# Altium schematic sheet Regulator_9V0_to_5V0.SchDoc: Buck Converter 9v to 5v0
size B; DocumentNumber: 1; Revision: 1; SheetNumber: 1; SheetTotal: 3
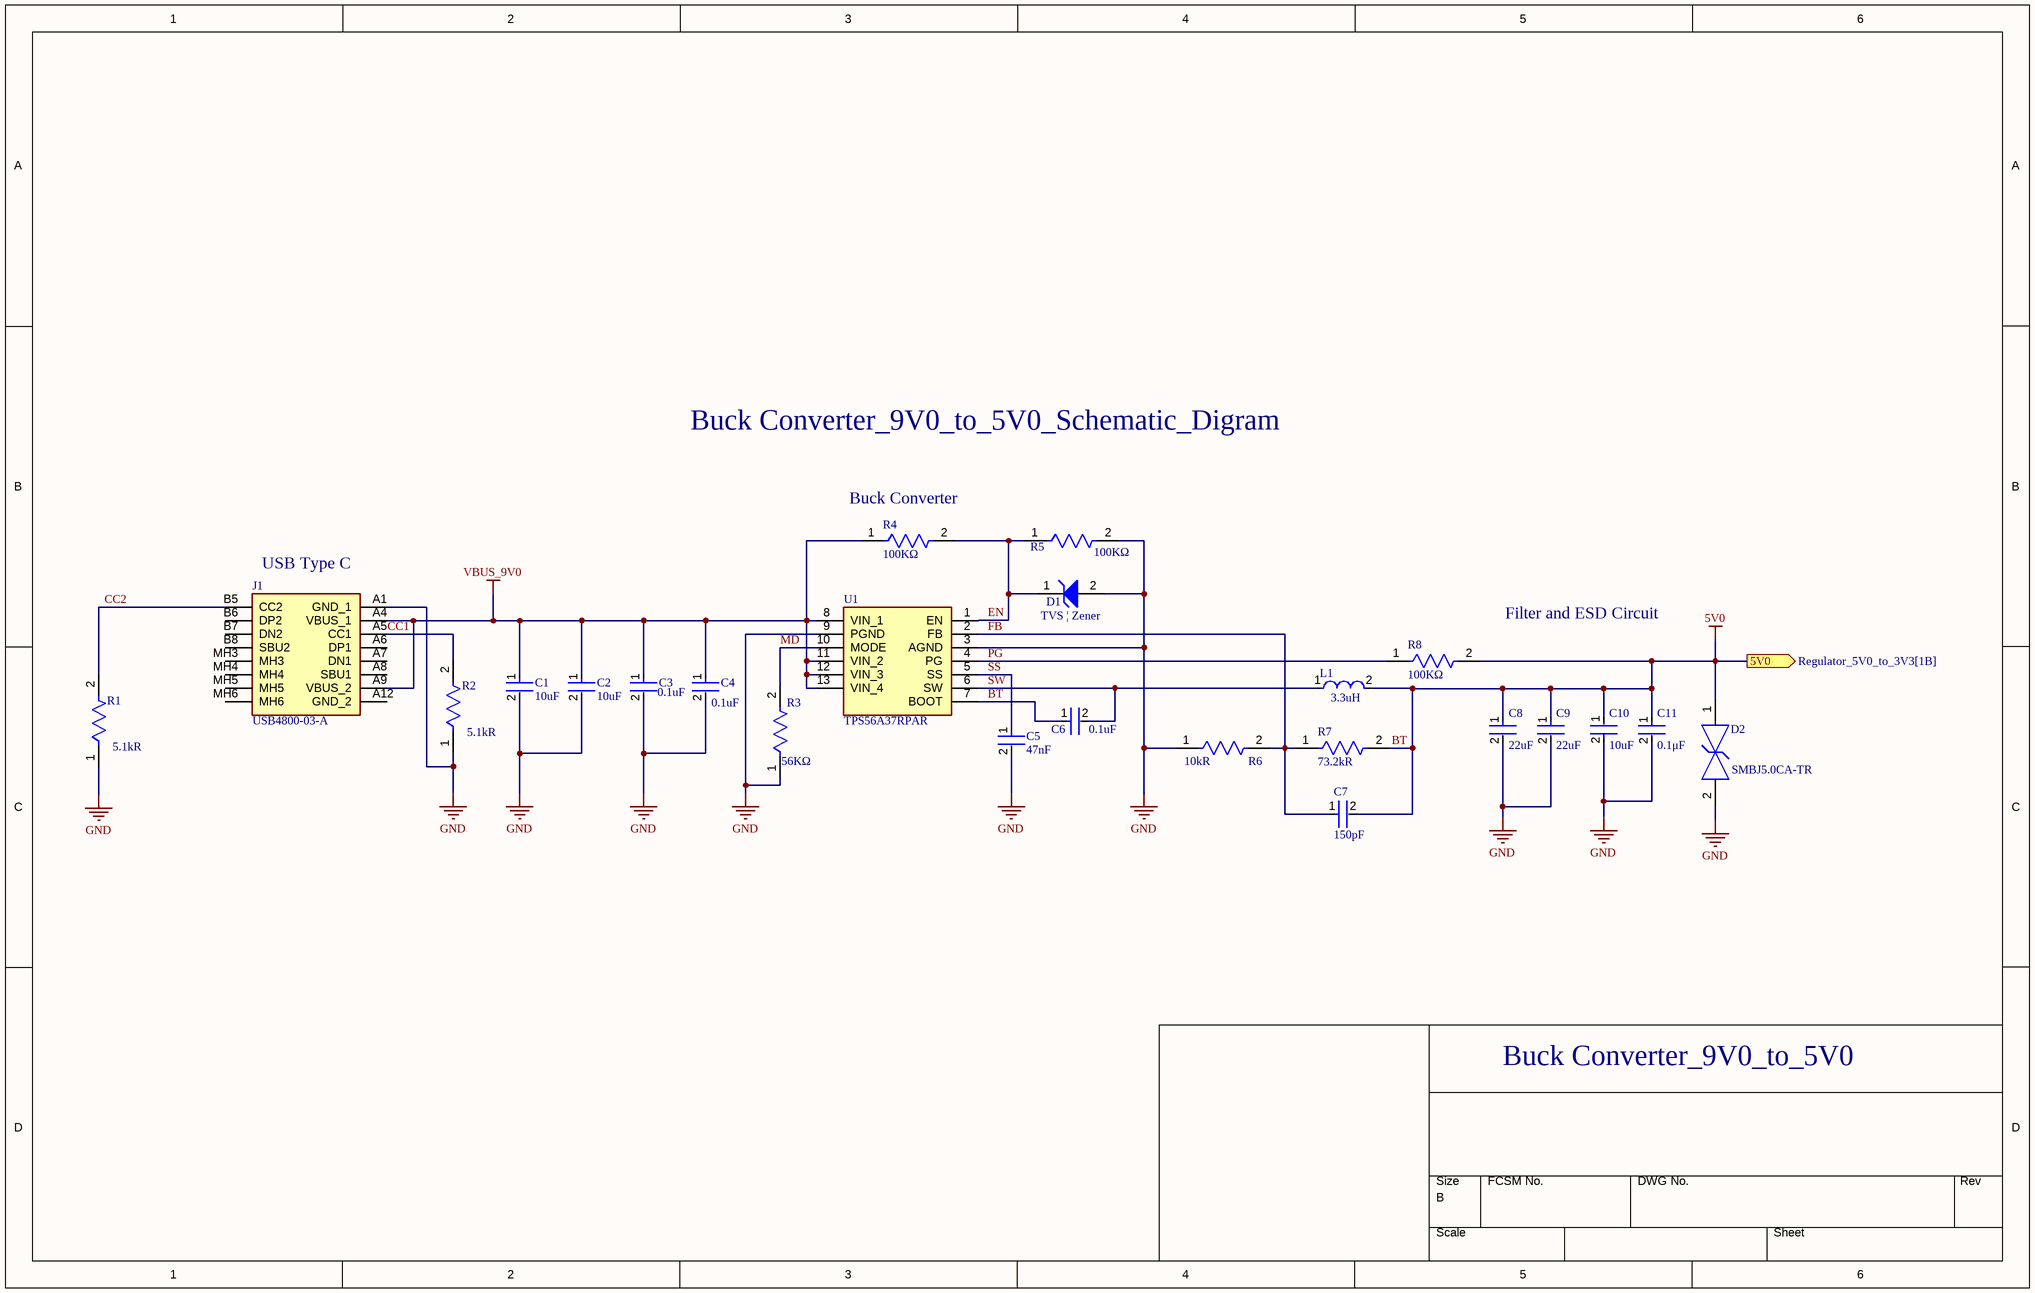
[diagram p0: Regulator_9V0_to_5V0.SchDoc]

## Parts
C1  Capacitance: 10uF  [FP-CL21-IPC_C]  (hidden comment: CL21A106KOQNNNG)
C2  Capacitance: 10uF  [FP-CL21-IPC_C]  (hidden comment: CL21A106KOQNNNG)
C3  Capacitance: 0.1uF  [FP-0402-L_1_0_1-W_0_5_0_1-IPC_B]  (hidden comment: 0402YD104KAT2A)
C4  Capacitance: 0.1uF  [FP-0402-L_1_0_1-W_0_5_0_1-IPC_B]  (hidden comment: 0402YD104KAT2A)
C5  Capacitance: 47nF  [FP-CL579-IPC_C]  (hidden comment: CL05B473KO5NNNC)
C6  Capacitance: 0.1uF  [FP-0402-L_1_0_1-W_0_5_0_1-IPC_B]  (hidden comment: 0402YD104KAT2A)
C7  Capacitance: 150pF  [FP-C1005-050-0_05-IPC_B]  (hidden comment: C1005NP01H151J050BA)
C8  Capacitance: 22uF  [FP-CL10-IPC_B]  (hidden comment: CL10A226MO7JZNC)
C9  Capacitance: 22uF  [FP-CL10-IPC_B]  (hidden comment: CL10A226MO7JZNC)
C10  Capacitance: 10uF  [FP-C1608-080-0_1-IPC_A]  (hidden comment: C1608X5R1A106M080AC)
C11  Capacitance: 0.1μF  [FP-C0603C-CF-MFG]  (hidden comment: C0603C104K8RACTU)
D1  ESD5Z6.0T1G  [ONSC-SOD-523-2-502-01_V]  (value not drawn)
D2  SMBJ5.0CA-TR  [FP-SMB-CA-MFG]
J1  USB4800-03-A  [USB480003A]
L1  Inductance: 3.3uH  [FP-IHLP-2020CZ-FP_1_905x2-MFG]  (hidden comment: IHLP2020CZER3R3M11)
R1  Resistance: 5.1kR  [FP-CRCW0402-e3-IPC_C]  (hidden comment: CRCW04025K10FKED)
R2  Resistance: 5.1kR  [FP-CRCW0402-e3-IPC_C]  (hidden comment: CRCW04025K10FKED)
R3  Resistance: 56KΩ  [FP-CRGCQ0402-IPC_C]  (hidden comment: CRGCQ0402F56K)
R4  Resistance: 100KΩ  [FP-CRGP0402-IPC_C]  (hidden comment: CRGP0402F100K)
R5  Resistance: 100KΩ  [FP-CRGP0402-IPC_C]  (hidden comment: CRGP0402F100K)
R6  Resistance: 10kR  [FP-AC0402-MFG]  (hidden comment: AC0402FR-0710KL)
R7  Resistance: 73.2kR  [FP-RC1005-IPC_B]  (hidden comment: RC1005F7322CS)
R8  Resistance: 100KΩ  [FP-CRGP0402-IPC_C]  (hidden comment: CRGP0402F100K)
U1  TPS56A37RPAR  [TPS56A37RPAR]

## Ports
5V0 (out, see Regulator_5V0_to_3V3[1B])

## Nets
BT: C6.1 C7.2 C8.1 C9.1 C10.1 C11.1 D2.1 L1.2 R7.2 R8.2 U1.7(BOOT) ; port 5V0  [also labelled 5V0]
GND: C1.2 C2.2 C3.2 C4.2 C5.2 C8.2 C9.2 C10.2 C11.2 D1.2(A) D2.2 J1.A1(GND_1) R1.1 R2.1 R3.1 R5.2 R6.1 U1.3(AGND) U1.9(PGND)
VBUS_9V0: C1.1 C2.1 C3.1 C4.1 J1.A4(VBUS_1) J1.A9(VBUS_2) R4.1 U1.8(VIN_1) U1.11(VIN_2) U1.12(VIN_3) U1.13(VIN_4)
CC1: J1.A5(CC1) R2.2
CC2: J1.B5(CC2) R1.2
EN: D1.1(K) R4.2 R5.1 U1.1(EN)
FB: C7.1 R6.2 R7.1 U1.2(FB)
MD: R3.2 U1.10(MODE)
PG: R8.1 U1.4(PG)
SS: C5.1 U1.5(SS)
SW: C6.2 L1.1 U1.6(SW)

Not connected (* = marked no-connect by the designer): J1 A6(DP1) A7(DN1) A8(SBU1) A12(GND_2) B6(DP2) B7(DN2) B8(SBU2) MH3 MH4 MH5 MH6

## Notes on the sheet
- Buck Converter_9V0_to_5V0_Schematic_Digram
- (near R4) Buck Converter
- (near J1) USB Type C
- (near D1) TVS | Zener
- Filter and ESD Circuit
- Buck Converter_9V0_to_5V0
- DWG. NO.
- REV.
- SHT.
- THIS DOCUMENT AND THE DATA DISCLOSED HEREIN OR HEREWITH IS THE PROPERTY OF ALTIUM LIMITED AND MAY BE FREELY DISTRIBUTED IN WHOLE. NO RIGHTS ARE RESERVED OR EXPRESS OR IMPLIED WARANTEE GIVEN.
- REVISION
- DESCRIPTION
- DATE
- APPROVED
- ENG:
- APPROVALS
- PROJECT
- DSN:
- CHK:
- REFERENCE DOCUMENTS
- PROJECT REVISION:
- TITLE
- DOCUMENT REVISION:
- DESIGN ITEM:
- BOM:
- FAB DWG:
- PCB DWG:
- ASSY DWG:
- SCALE:
- SIZE
- B
- CAGE CODE
- FILE NAME
- DWG NO.
- SHEET
- OF
- REV

## Library data of the parts
C1 C2 = CMP-13271-002240-1: CL21 Series 0805 10uF 16V ±10% Tolerance X5R Multilayer Ceramic Chip Capacitor; Case Code (Metric): 2012; Package Quantity: 3000; Width: 0.049inch; Mount: Surface Mount; Depth: 1.25mm; Material: Ceramic; Min Operating Temperature: -55°C; Thickness: 0.053inch; Tolerance: 10%; Case Code (Imperial): 0805; Packaging: Tape and Reel; Voltage Rating: 16V; Case/Package: 0805; Height: 1.25mm; Voltage: 16V; Max Operating Temperature: 85°C; Length: 2mm; Dielectric: X5R
C3 C4 C6 = CMP-2008-02842-2: General Purpose Ceramic Capacitor, 0402, 10uF, 10%, X5R, 15%, 16V; Dissipation Factor: 3.5%; Case Code (Metric): 1005; Packaging: Tape and Reel; Voltage Rating: 16V; Voltage: 16V; REACH SVHC: No SVHC; Width: 0.02inch; Thickness: 0.022inch; Max Operating Temperature: 85°C; Dielectric: X5R; Mount: Surface Mount; Package Quantity: 1; Length: 1mm; Termination: SMD/SMT; Voltage Rating (DC): 16V; Construction: Flat; Contact Plating: Tin; Depth: 0.5mm; Tolerance: 10%; RoHS Compliant: Yes; Min Operating Temperature: -55°C; Case Code (Imperial): 0402; Height: 0.56mm; Case/Package: 0402; Radiation Hardening: No; Lead Free: Lead Free; Series: -
C5 = CMP-13271-000643-1: Cap Ceramic 47nF 16V X7R ±10% SMD 0402 +125°C Paper T/R; Voltage Rating (DC): 16V; Mount: Surface Mount; Max Operating Temperature: 125°C; Radiation Hardening: No; Voltage: 16V; Length: 1mm; Package Quantity: 1; Tolerance: 10%; Width: 0.02inch; Case/Package: 0402; Case Code (Metric): 1005; Height: 0.5mm; Packaging: Tape and Reel; Depth: 0.5mm; Lead Free: Lead Free; Min Operating Temperature: -55°C; Case Code (Imperial): 0402; Voltage Rating: 16V; Contact Plating: Tin; Dielectric: X7R; Thickness: 0.022inch
C7 = CMP-08246-007033-1: Multilayer Ceramic Capacitors 150pF ±5% 50V NP0 SMD 0402; Dielectric: C0G; Case Code (Imperial): 0402; Tolerance: 5%; Voltage Rating (DC): 50V; Max Operating Temperature: 150°C; RoHS Compliant: Yes; Packaging: Tape and Reel; Min Operating Temperature: -55°C; Series: C; Termination: SMD/SMT; Length: 0.039inch; Voltage Rating: 50V; Package Quantity: 10000; Weight: 2.3E-05oz; Height: 0.5mm; Mount: Surface Mount; Features: High Temperature; Width: 0.02inch; Thickness: 0.022inch; Case Code (Metric): 1005; Case/Package: 0402
C8 C9 = CMP-13271-002755-1: Cap Ceramic 22uF 16V X5R ±20% Pad SMD 0603 +85°C T/R; Mount: Surface Mount; Packaging: Tape and Reel; Case Code (Imperial): 0603; Max Operating Temperature: 85°C; Case/Package: 0603; Voltage Rating: 16V; Tolerance: 20%; Case Code (Metric): 1608; Min Operating Temperature: -55°C
C10 = CMP-2000-04980-2: Multilayer Ceramic Capacitors 10μF ±20% 10V X5R SMD 0603; Min Operating Temperature: -55°C; RoHS Compliant: Yes; Package Quantity: 1; Max Operating Temperature: 85°C; Radiation Hardening: No; Packaging: Tape and Reel; REACH SVHC: No SVHC; Length: 1.6mm; Case/Package: 0603; Series: C; Voltage Rating: 10V; Thickness: 0.035inch; Weight: 7.1E-05oz; Dielectric: X5R; Termination: SMD/SMT; Dielectric Material: Ceramic; Mount: Surface Mount; Construction: Flat; Resistor Type: Ceramic; Tolerance: 20%; Case Code (Metric): 1608; Number of Pins: 2; Case Code (Imperial): 0603; Depth: 0.8mm; Lead Free: Lead Free; Width: 0.031inch; Height: 0.8mm; Voltage Rating (DC): 10V
C11 = CMP-1035-02580-3: CAP CER 0.1UF 10V X7R 0603; Manufacturer: KEMET; Tolerance: 0.1; Material: Ceramic; Value: 0.10 μF; Temperature Coefficient: 30ppm/°C; Automotive Grade: Grade 1; Digikey Description: CAP CER 0.1UF 10V X7R 0603; Temperature Range High: +125°C; RoHS: TRUE; ComponentLink2URL: https://api.kemet.com/component-edge/download/datasheet/C0603C100J5GACAUTO.pdf; Lead Free: Yes; Device Class L2: Capacitors; Mouser Description: Multilayer Ceramic Capacitors MLCC - SMD/SMT 10volts 0.1uF X7R 10%; Temperature: -55°C to +125°C; Category: Cap; Height: 0.87mm; Voltage Rating: 10 V; Device Class L3: Ceramic Capacitors; ComponentLink2Description: Datasheet; Automotive: Yes; Manufacturer Part Number: C0603C104K8RACTU; Octopart: https://octopart.com/c0603c104k8ractu-kemet-145075; Temperature Characteristic: X7R; Device Class L1: Passive Components; Temperature Range Low: -55°C; Package: C0603C-CF
D1 = CMP-1063-00101-1: Transient Voltage Suppressor, Micro-Packaged Diode for ESD Protection, 2-Pin SOD-523, Pb-Free, Tape and Reel; Manufacturer: On Semiconductor; PPK Max (W): 181; Direction: Unidirectional; Number of Lines: 1; V(BR) Min (V): 6.8; IR Max (uA): 0.01; VRWM Max (V): 6; Packing: Tape and Reel; PackageReference: SOD-523-2-502-01; Mounting Technology: Surface Mount; RoHS: Pb-Free; ComponentLink2Description: Datasheet; PackageVersion: Rev. E, 09/2010; ComponentLink2URL: http://www.onsemi.cn/pub_link/Collateral/ESD5Z2.5T1-D.PDF; PackageDescription: 2-Pin SOD, Body 1.2 x 0.8 mm; DatasheetVersion: Rev. 10; ComponentLink3Description: Package Specification; ComponentLink3URL: http://www.onsemi.com/pub_link/Collateral/502-01.PDF; ComponentLink1URL: http://www.onsemi.com/; ComponentLink1Description: Manufacturer URL; PartNumber: ESD5Z6.0T1G
D2 = CMP-12225-000020-1: TVS DIODE 5V 13.4V SMB; Manufacturer: STMicroelectronics; Max Junction Temp: +150°C; Number Of Channels: 1; Peak Pulse Current: 68A; Standoff Height: 0.05mm; Direction: Bidirectional; Peak Pulse Power: 600W; Clamping Voltage: 9.2V; Breakdown Voltage: 6.4V; Manufacturer Part Number: SMBJ5.0CA-TR; Device Class L3: unset; Temperature Range Low: -55°C; Digikey Description: TVS DIODE 5V 13.4V SMB; Device Class L2: TVS Diodes; Mouser Description: TVS Diodes - Transient Voltage Suppressors 600W 5.0V Bidirect; Height: 2.65mm; ComponentLink2Description: Datasheet; Lead Free: Yes; RoHS: TRUE; Device Class L1: Circuit Protection; Package: SMB-CA; Reverse Standoff Voltage: 5V; ComponentLink2URL: https://www.st.com/content/ccc/resource/technical/document/datasheet/19/78/91/39/07/cd/40/65/CD00001366.pdf/files/CD00001366.pdf/_jcr_content/translations/en.CD00001366.pdf; Temperature: -55°C to +150°C; Automotive: No; Octopart: https://octopart.com/smbj5.0ca-tr-stmicroelectronics-347080; Temperature Range High: +150°C; Category: Diode
J1 = USB4800-03-A: Connector; Manufacturer_Name: GCT (GLOBAL CONNECTOR TECHNOLOGY); Datasheet Link: https://gct.co/connector/usb4800; Height: 5.58mm; Manufacturer_Part_Number: USB4800-03-A; Mouser Part Number: 640-USB4800-03-A; Mouser Price/Stock: https://www.mouser.co.uk/ProductDetail/GCT/USB4800-03-A?qs=vvQtp7zwQdMkfG8vViEZoQ%3D%3D
L1 = CMP-02424-000463-1: Fixed Inductors Commercial Low DCR Series 3.3uH 5.5A 40.4mΩ 20%; DC Resistance (DCR): 40.4mR; Self Resonant Frequency: 29MHz; Saturation Current: 7A; Test Frequency: 100kHz; Shielding: Shielded; Depth: 5.43mm; Termination: SMD/SMT; Width: 0.204inch; Packaging: Tape and Reel; Height: 3mm; Height - Seated (Max): 0.118inch; Military Standard: Not; RMS Current (Irms): 5.5A; Current Rating: 5.5A; Radiation Hardening: No; Case/Package: 2020; Tolerance: 20%; Min Operating Temperature: -55°C; Package Quantity: 2000; Contact Plating: Tin; Mount: Surface Mount; Inductance Tolerance: 20%; Length: 5.74mm; Lead Free: Lead Free; Max DC Current: 7A; Max Operating Temperature: 125°C
R1 R2 = CMP-1011-00590-4: RES Thick Film, 5.1kΩ, 1%, 0.063W, 100ppm/°C, 0402; Voltage Rating: 50V; Max Power Dissipation: 63mW; Case/Package: 0402; Min Operating Temperature: -55°C; Height: 0.35mm; Contact Plating: Tin; Tolerance: 1%; Max Operating Temperature: 155°C; Lead Free: Lead Free; Number of Terminations: 2; Temperature Coefficient: 100ppm/°C; Weight: 2.3E-05oz; Termination: SMD/SMT; Radiation Hardening: No; Voltage Rating (DC): 50V; Length: 1mm; Features: Automotive AEC-Q200; Case Code (Metric): 1005; Width: 0.02inch; Package Quantity: 10; Military Standard: Not; Depth: 0.5mm; Packaging: Tape and Reel; Power Rating: 63mW; Case Code (Imperial): 0402; Composition: Thick Film
R3 = CMP-03211-009184-1: CRGCQ 0402 56K 1%; Manufacturer: TE Connectivity; Temperature Coefficient: ±100ppm/°C; Value: 56KΩ; Voltage Rating: 50V; Power Rating: 0.0625W; Tolerance: 0.01; Device Class L3: Chip SMD Resistors; ComponentLink2URL: https://www.te.com/commerce/DocumentDelivery/DDEController?Action=showdoc&DocId=Data+Sheet%7F1773204-3%7F1%7Fpdf%7FEnglish%7FENG_DS_1773204-3_1.pdf%7F4-2176347-1092; RoHS: TRUE; Octopart: https://octopart.com/crgcq0402f56k-te+connectivity-91017978; Composition: Thick Film; Height: 0.4mm; Ipc Land Pattern Name: RESC10050X35; Series: CRGCQ; Device Class L2: Resistors; Temperature: -55°C to +155°C; Manufacturer Part Number: CRGCQ0402F56K; Device Class L1: Passive Components; Temperature Range Low: -55°C; Digikey Description: CRGCQ 0402 56K 1%; Lead Free: Yes; Automotive: Yes; ComponentLink2Description: Datasheet; Temperature Range High: +155°C; Ambient Temperature Range High: +70°C; Package: CRGCQ0402; Category: Res
R4 R5 R8 = CMP-03211-001392-1: SMD Precision Pulse Thick Film Chip Resistor; Manufacturer: TE; Value: 100KΩ; Power Rating: 0.125W; Tolerance: 0.01; Temperature Coefficient: ±100ppm/°C; Voltage Rating: 50V; Octopart: https://octopart.com/crgp0402f100k-te+connectivity-91018658; Ipc Land Pattern Name: RESC11050X35; Digikey Description: SMD Precision Pulse Thick Film Chip Resistor; Composition: Thick Film; Device Class L3: Chip SMD Resistors; Package: CRGP0402; Manufacturer Part Number: CRGP0402F100K; Temperature: -55°C to +155°C; Category: Res; Device Class L1: Passive Components; Temperature Range High: +155°C; ComponentLink2URL: https://www.mouser.ca/datasheet/2/418/NG_DS_9-1773463-9_A-1358566.pdf; Temperature Range Low: -55°C; Series: CRGP; Automotive: No; Lead Free: Yes; RoHS: TRUE; Device Class L2: Resistors; Height: 0.4mm; ComponentLink2Description: Datasheet
R6 = CMP-2002-01790-3: RES 10kΩ ±1% 0.063W 0402; Power Rating: 62.5mW; Voltage Rating: 50V; Temperature Coefficient: 100ppm/°C; Max Power Dissipation: 63mW; Tolerance: 1%; Military Standard: Not; Construction: Rectangular; Termination: SMD/SMT; Max Operating Temperature: 155°C; Min Operating Temperature: -55°C; Height: 0.015inch; Lead Free: Lead Free; Width: 0.02inch; Case/Package: 0402; Resistor Type: Thick Film; Series: AC; Features: Moisture Resistant; RoHS Compliant: Yes; Number of Terminations: 2; Case Code (Metric): 1005; Length: 0.039inch; Depth: 0.5mm; Size Code: 0402; Packaging: Tape and Reel; Case Code (Imperial): 0402
R7 = CMP-13261-004133-1: Res Thick Film 0402 73.2kΩ 1% 0.063W ±100ppm/°C Molded SMD T/R; Voltage Rating (DC): 50V; Power Rating: 63mW; Tolerance: 1%; Contact Plating: Tin; Features: Moisture Resistant; Case Code (Imperial): 0402; Length: 1mm; Lead Free: Lead Free; Case Code (Metric): 1005; Packaging: Tape and Reel; Number of Terminations: 2; Max Operating Temperature: 155°C; Military Standard: Not; Height: 0.016inch; Case/Package: 0402; Radiation Hardening: No; Depth: 0.5mm; Min Operating Temperature: -55°C; Temperature Coefficient: 100ppm/°C; Max Power Dissipation: 63mW; Composition: Thick Film; Width: 0.02inch; Package Quantity: 1
U1 = TPS56A37RPAR: Integrated Circuit; Manufacturer_Name: Texas Instruments; Datasheet Link: https://www.ti.com/lit/ds/symlink/tps56a37.pdf?ts=1708310049261&ref_url=https%253A%252F%252Fwww.ti.com%252Fproduct%252FTPS56A37; Height: 1mm; Manufacturer_Part_Number: TPS56A37RPAR; Mouser Part Number: 595-TPS56A37RPAR; Mouser Price/Stock: https://www.mouser.co.uk/ProductDetail/Texas-Instruments/TPS56A37RPAR?qs=dbcCsuKDzFV3BmG4b9YeGQ%3D%3D; Arrow Part Number: TPS56A37RPAR; Arrow Price/Stock: https://www.arrow.com/en/products/tps56a37rpar/texas-instruments?utm_currency=USD&region=nac